# Altium schematic sheet Output_dig2.SchDoc
size A4
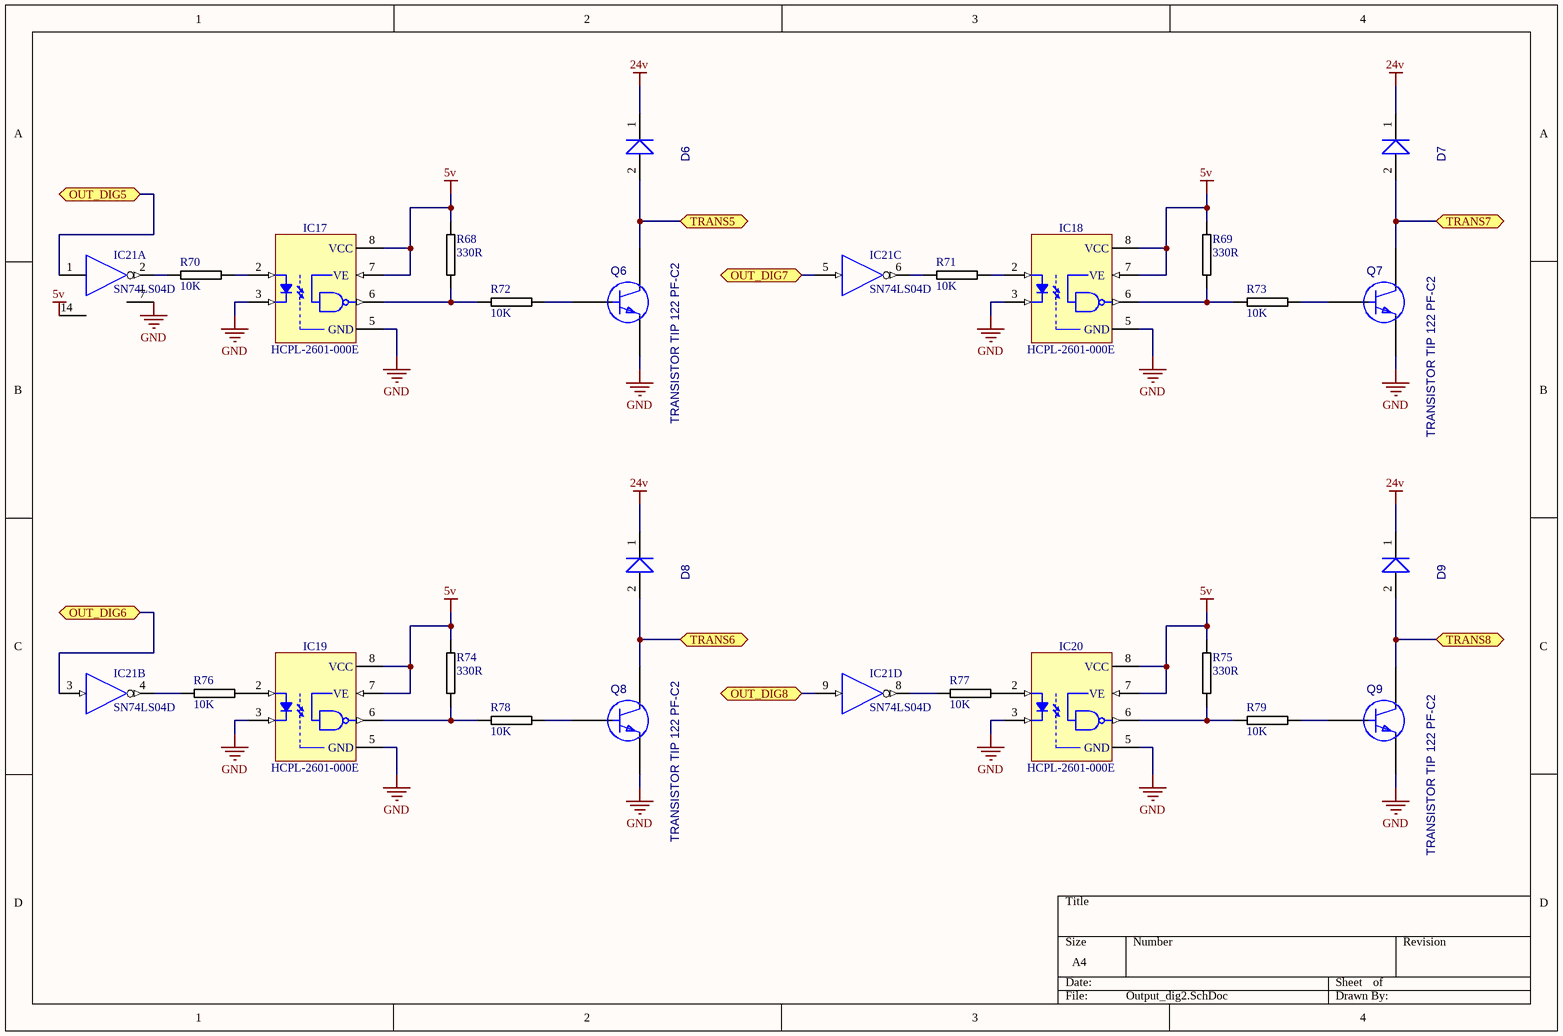
[diagram p0: Output_dig2.SchDoc]

## Parts
D6  DIODO 1N4007 PF-B1  [DIODO DO41 PF-B1]  (value not drawn)
D7  DIODO 1N4007 PF-B1  [DIODO DO41 PF-B1]  (value not drawn)
D8  DIODO 1N4007 PF-B1  [DIODO DO41 PF-B1]  (value not drawn)
D9  DIODO 1N4007 PF-B1  [DIODO DO41 PF-B1]  (value not drawn)
IC17  HCPL-2601-000E  [DIP8-300]
IC18  HCPL-2601-000E  [DIP8-300]
IC19  HCPL-2601-000E  [DIP8-300]
IC20  HCPL-2601-000E  [DIP8-300]
IC21  SN74LS04D  [SOIC127P600X175-14N]  (parts A,B,C,D of 6)
Q6  TRANSISTOR TIP 122 PF-C2  [TRANSISTOR TO220 PF-C2]
Q7  TRANSISTOR TIP 122 PF-C2  [TRANSISTOR TO220 PF-C2]
Q8  TRANSISTOR TIP 122 PF-C2  [TRANSISTOR TO220 PF-C2]
Q9  TRANSISTOR TIP 122 PF-C2  [TRANSISTOR TO220 PF-C2]
R68  330R  [0805R-330]
R69  330R  [0805R-330]
R70  10K  [0805R-10K]
R71  10K  [0805R-10K]
R72  10K  [0805R-10K]
R73  10K  [0805R-10K]
R74  330R  [0805R-330]
R75  330R  [0805R-330]
R76  10K  [0805R-10K]
R77  10K  [0805R-10K]
R78  10K  [0805R-10K]
R79  10K  [0805R-10K]

## Ports
OUT_DIG5, OUT_DIG6, OUT_DIG7, OUT_DIG8, TRANS5, TRANS6, TRANS7, TRANS8

## Nets
5v: IC17.7(VE) IC17.8(VCC) IC18.7(VE) IC18.8(VCC) IC19.7(VE) IC19.8(VCC) IC20.7(VE) IC20.8(VCC) IC21.14(VCC) R68.1 R69.1 R74.1 R75.1
24v: D6.1(K) D7.1(K) D8.1(K) D9.1(K)
GND: IC17.3(K) IC17.5(GND) IC18.3(K) IC18.5(GND) IC19.3(K) IC19.5(GND) IC20.3(K) IC20.5(GND) IC21.7(GND) Q6.3(E) Q7.3(E) Q8.3(E) Q9.3(E)
VCC: IC21.14(VCC)
OUT_DIG5: IC21.1(A) ; port OUT_DIG5
OUT_DIG6: IC21.3(A) ; port OUT_DIG6
OUT_DIG7: IC21.5(A) ; port OUT_DIG7
OUT_DIG8: IC21.9(A) ; port OUT_DIG8
TRANS5: D6.2(A) Q6.2(C) ; port TRANS5
TRANS6: D8.2(A) Q8.2(C) ; port TRANS6
TRANS7: D7.2(A) Q7.2(C) ; port TRANS7
TRANS8: D9.2(A) Q9.2(C) ; port TRANS8
NetIC17_2: IC17.2(A) R70.2
NetIC17_6: IC17.6(VO) R68.2 R72.1
NetIC18_2: IC18.2(A) R71.2
NetIC18_6: IC18.6(VO) R69.2 R73.1
NetIC19_2: IC19.2(A) R76.2
NetIC19_6: IC19.6(VO) R74.2 R78.1
NetIC20_2: IC20.2(A) R77.2
NetIC20_6: IC20.6(VO) R75.2 R79.1
NetIC21_2: IC21.2(~{O}) R70.1
NetIC21_4: IC21.4(~{O}) R76.1
NetIC21_6: IC21.6(~{O}) R71.1
NetIC21_8: IC21.8(~{O}) R77.1
NetQ6_1: Q6.1(B) R72.2
NetQ7_1: Q7.1(B) R73.2
NetQ8_1: Q8.1(B) R78.2
NetQ9_1: Q9.1(B) R79.2

## Library data of the parts
D6-D9 = DIODO 1N4007 PF-B1: cod: 606000120; Compra: 302003193; 3D comp: DIODO DO41 PF-B1; Descri: DIODO 1N4007 PF-B1; SCH: DIODO 1N4007 PF-B1
IC17-IC20 = HCPL-2601-000E: Single Optocoupler; Part Description: High CMR, High Speed TTL Compatible Optocouplers; Manufacturer: AVAGO TECHNOLOGIES; Table: Optocouplers; Part Number: HCPL-2601-000E; Component Kind: Standard; Component Type: Standard; Device: HCPL-2601-000E; PackageDescription: DIP; 8 Leads; Row Spacing 7.62 mm; Pitch 2.54 mm; Manufacturer Part Number: HCPL-2601-000E; Pin Count: 8; Case: DIP8-300; Mounted: Yes; Socket: Yes; SMD: No; ComponentHeight: 4.7mm; HelpURL: \\cern.ch\dfs\Applications\Altium\Datasheets\HCPL-2601-000E.pdf; Author: CERN DEM JLC; CreateDate: 30/03/2009; LatestRevisionDate: 30/03/2009
IC21 = SN74LS04D: Hex Inverter; Part Description: Hex Inverters; Manufacturer: TEXAS INSTRUMENTS; Table: Standard Logic; Part Number: SN74LS04D; Component Kind: Standard; Component Type: Standard; Device: SN74LS04D; PackageDescription: SOIC 14, Pitch 1.27mm - Body 4x8.75mm, IPC Medium Density; Manufacturer Part Number: SN74LS04D; Pin Count: 14; Case: SOIC14; Mounted: Yes; Socket: No; SMD: Yes; ComponentHeight: 1.75mm; Author: CERN DEM JLC; HelpURL: \\cern.ch\dfs\Applications\Altium\Datasheets\SN74LS04D.pdf; CreateDate: 20/05/2010; LatestRevisionDate: 20/05/2010
Q6-Q9 = TRANSISTOR TIP 122 PF-C2: cod: 606000213; Compra: 302003328; 3D comp: TRANSISTOR TO220 PF-C2; Descri: TRANSISTOR TIP 122 PF-C2; SCH: TRANSISTOR TIP 122 PF-C2
R68 R69 R74 R75 = 0805R-330: RESISTOR 0805 1/4 WATT THIN FILM; Reel: *
R70-R73 R76-R79 = 0805R-10K: RESISTOR 0805 1/4 WATT THIN FILM; Reel: *